# EAGLE design adrone_v1 (EAGLE 8.3.1)
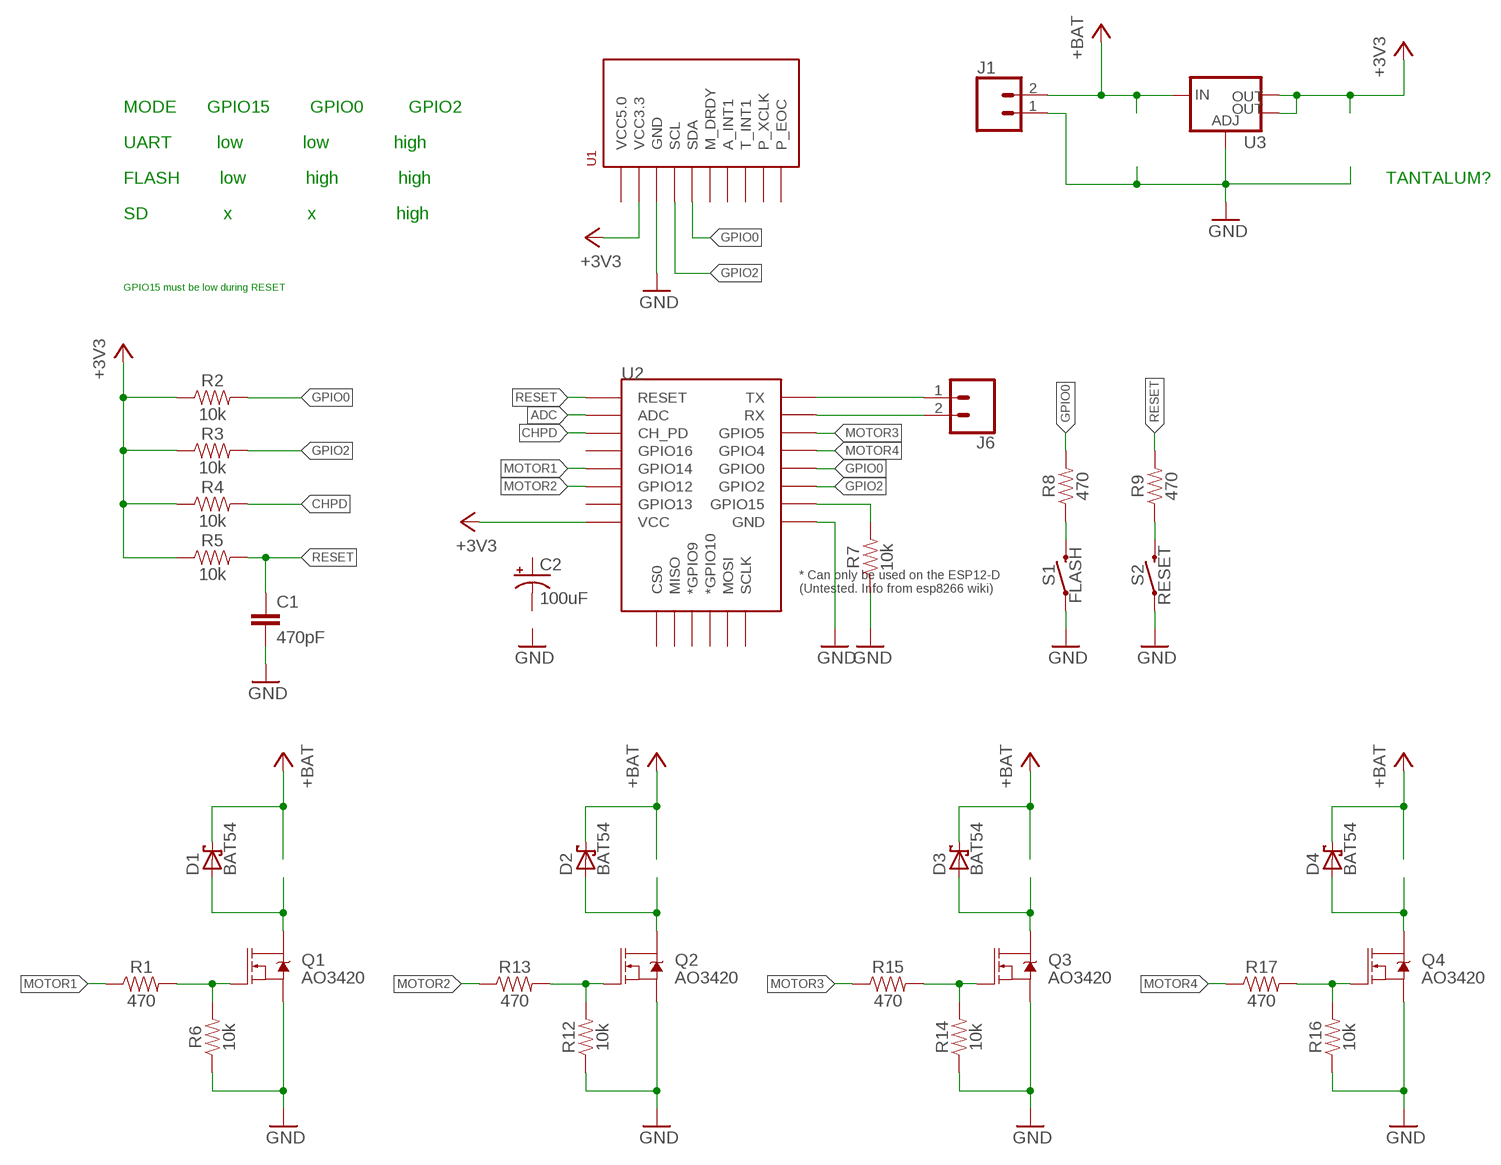
[diagram p0: schematic, sheet 1]

## Parts
C1  470pF  10NF-0603-50V-10%  [0603]
C2  100uF  100UF-POLAR-EIA7343-10V-10%(TANT)  [EIA7343]
D1  BAT54  [SOT23]
D2  BAT54  [SOT23]
D3  BAT54  [SOT23]
D4  BAT54  [SOT23]
J1  CONN_02  [1X02]
J6  CONN_02  [1X02]
Q1  AO3420  MOSFET-NCH-AO3404A  [SOT23-3]
Q2  AO3420  MOSFET-NCH-AO3404A  [SOT23-3]
Q3  AO3420  MOSFET-NCH-AO3404A  [SOT23-3]
Q4  AO3420  MOSFET-NCH-AO3404A  [SOT23-3]
R1  470  10KOHM-0603-1/10W-1%  [0603]
R2  10k  10KOHM-0603-1/10W-1%  [0603]
R3  10k  10KOHM-0603-1/10W-1%  [0603]
R4  10k  10KOHM-0603-1/10W-1%  [0603]
R5  10k  10KOHM-0603-1/10W-1%  [0603]
R6  10k  10KOHM-0603-1/10W-1%  [0603]
R7  10k  10KOHM-0603-1/10W-1%  [0603]
R8  470  470OHM-0603-1/10W-1%  [0603]
R9  470  470OHM-0603-1/10W-1%  [0603]
R12  10k  10KOHM-0603-1/10W-1%  [0603]
R13  470  10KOHM-0603-1/10W-1%  [0603]
R14  10k  10KOHM-0603-1/10W-1%  [0603]
R15  470  10KOHM-0603-1/10W-1%  [0603]
R16  10k  10KOHM-0603-1/10W-1%  [0603]
R17  470  10KOHM-0603-1/10W-1%  [0603]
S1  FLASH  MOMENTARY-SWITCH-SPST-SMD-6.0X3.5MM  [TACTILE_SWITCH_SMD_6.0X3.5MM]
S2  RESET  MOMENTARY-SWITCH-SPST-SMD-6.0X3.5MM  [TACTILE_SWITCH_SMD_6.0X3.5MM]
U1  GY-80_10DOF  [GY-80_10DOF]
U2  ESP12ESMD  [ESP12E-SMD]
U3  V_REG_LM1117SOT223  [SOT223]

## Nets
+3V3: R2.1 R3.1 R4.1 R5.1 U1.P$2(VCC3.3) U2.VCC U3.2(OUT) U3.4(OUT)
+BAT: D1.3(C) D2.3(C) D3.3(C) D4.3(C) J1.2 U3.3(IN)
ADC: U2.ADC
CHPD: R4.2 U2.CH_PD
GND: C1.2 J1.1 Q1.2(S) Q2.2(S) Q3.2(S) Q4.2(S) R6.1 R7.1 R12.1 R14.1 R16.1 S1.1 S2.1 U1.P$3(GND) U2.GND U3.1(ADJ)
GPIO0: R2.2 R8.2 U1.P$5(SDA) U2.GPIO0
GPIO2: R3.2 U1.P$4(SCL) U2.GPIO2
MOTOR1: R1.1 U2.GPIO14
MOTOR2: R13.1 U2.GPIO12
MOTOR3: R15.1 U2.GPIO5
MOTOR4: R17.1 U2.GPIO4
N$1: D1.1(A) Q1.3(D)
N$3: Q2.1(G) R12.2 R13.2
N$4: D2.1(A) Q2.3(D)
N$6: Q3.1(G) R14.2 R15.2
N$7: R7.2 U2.GPIO15
N$8: D3.1(A) Q3.3(D)
N$10: Q4.1(G) R16.2 R17.2
N$11: J6.2 U2.RXD0(RX)
N$12: D4.1(A) Q4.3(D)
N$14: Q1.1(G) R1.2 R6.2
N$18: R8.1 S1.2
N$20: R9.1 S2.2
RESET: C1.1 R5.2 R9.2 U2.RESET
TX: J6.1 U2.TXD0(TX)
Unconnected: C2.A(+) C2.C(-) U1.P$1(VCC5.0) U1.P$6(M_DRDY) U1.P$7(A_INT1) U1.P$8(T_INT1) U1.P$9(P_XCLK) U1.P$10(P_EOC) U2.CS0 U2.GPIO9(*GPIO9) U2.GPIO10(*GPIO10) U2.GPIO13 U2.GPIO16 U2.MISO U2.MOSI U2.SCLK

## Notes on the sheet
- MODE      GPIO15        GPIO0         GPIO2
- UART         low            low             high
- FLASH        low            high            high | TANTALUM?
- SD               x               x                high
- GPIO15 must be low during RESET

## Library data of the parts
C1 = SparkFun-Capacitors:10NF: 0.01uF/10nF/10,000pF ceramic capacitors A capacitor is a passive two-terminal electrical component used to store electrical energy temporarily in an electric field. CAP-09321; PROD_ID: CAP-00867; VALUE: 10nF
C2 = SparkFun-Capacitors:100UF-POLAR: 100µF polarized capacitors A capacitor is a passive two-terminal electrical component used to store electrical energy temporarily in an electric field.; PROD_ID: CAP-07890
D1-D4 = diode:BAT54: Schottky Diodes Source: Fairchild .. BAT54.pdf
J1 J6 = SparkFun-Connectors:CONN_02: Multi connection point. Often used as Generic Header-pin footprint for 0.1 inch spaced/style header connections On any of the 0.1 inch spaced packages, you can populate with these: Break Away Headers - Straight <https://www.sparkfun.com/products/116> (PRT-00116) Break Away Male Headers - Right Angle <https://www.sparkfun.com/products/553> (PRT-00553) Female Headers <https://www.sparkfun.com/products/115> (PRT-00115) Break Away Headers - Machine Pin <https://www.sparkfun.com/products/117> (PRT-00117) Break Away Female Headers - Swiss Machine Pin <https://www.sparkfun.com/products/743> (PRT-00743) For SCREWTERMINALS and SPRING TERMINALS visit here: Screw Terimnals on SparkFun.com <https://www.sparkfun.com/search/results?term=Screw+Terminals> (5mm/3.5mm/2.54mm spacing) This device is also useful as a general connection point to wire up your design to another part of your project. Our various solder wires solder well into these plated through hole pads. Hook-Up Wire - Assortment (Stranded, 22 AWG) <https://www.sparkfun.com/products/11375> (PRT-11375) Hook-Up Wire - Assortment (Solid Core, 22 AWG) <https://www.sparkfun.com/products/11367> (PRT-11367) View the entire wire category on our website here <https://www.sparkfun.com/categories/141> Special notes: Molex polarized connector foot print use with: PRT-08233 with associated crimp pins and housings. 2.54_SCREWTERM for use with PRT-10571. 3.5mm Screw Terminal footprints for PRT-08084 5mm Screw Terminal footprints for use with PRT-08432
Q1-Q4 = SparkFun-DiscreteSemi:MOSFET-NCH: N-channel MOSFETs Voltage controlled devices that allow control of high current outputs. SparkFun Products: SparkFun OpenScale <https://www.sparkfun.com/products/13261> SparkFun Digital Sandbox <https://www.sparkfun.com/products/12651> SparkFun Monster Moto Shield <https://www.sparkfun.com/products/10182> SparkFun MOSFET Power Controller <https://www.sparkfun.com/products/11214>; PROD_ID: TRANS-12988; VALUE: 5.8A/30V/35mΩ
R1 R13 R15 R17 = SparkFun-Resistors:10KOHM: 10kΩ resistor A resistor is a passive two-terminal electrical component that implements electrical resistance as a circuit element. Resistors act to reduce current flow, and, at the same time, act to lower voltage levels within circuits. - Wikipedia; PROD_ID: RES-00824; VALUE: 10k
R2-R7 R12 R14 R16 = SparkFun-Resistors:10KOHM: 10kΩ resistor A resistor is a passive two-terminal electrical component that implements electrical resistance as a circuit element. Resistors act to reduce current flow, and, at the same time, act to lower voltage levels within circuits. - Wikipedia; PROD_ID: RES-00824
R8 R9 = SparkFun-Resistors:470OHM: 470Ω resistor A resistor is a passive two-terminal electrical component that implements electrical resistance as a circuit element. Resistors act to reduce current flow, and, at the same time, act to lower voltage levels within circuits. - Wikipedia; PROD_ID: RES-07869
S1 S2 = SparkFun-Switches:MOMENTARY-SWITCH-SPST: Momentary Switch (Pushbutton) - SPST Normally-open (NO) SPST momentary switches (buttons, pushbuttons). Variants PTH-12MM - 12mm square, through-hole Momentary Pushbutton Switch - 12mm Square <https://www.sparkfun.com/products/9190> (COM-09190) PTH-6.0MM, PTH-6.0MM-KIT - 6.0mm square, through-hole Mini Pushbutton Switch <https://www.sparkfun.com/products/97> (COM-00097) KIT package intended for soldering kit's - only one side of pads' copper is exposed. PTH-RIGHT-ANGLE-KIT - Right-angle, through-hole Right Angle Tactile Button <https://www.sparkfun.com/products/10791> - Used on SparkFun BigTime Watch Kit <https://www.sparkfun.com/products/11734> SMD-12MM - 12mm square, surface-mount Tactile Button - SMD (12mm) <https://www.sparkfun.com/products/12993> (COM-12993) Used on SparkFun PicoBoard <https://www.sparkfun.com/products/11888> SMD-4.5MM - 4.5mm Square Trackball Switch Used on SparkFun Blackberry Trackballer Breakout <https://www.sparkfun.com/products/13169> SMD-4.6MMX2.8MM - 4.60mm x 2.80mm, surface mount Used on SparkFun SAMD21 Mini Breakout <https://www.sparkfun.com/products/13664> SMD-5.2MM, SMD-5.2-REDUNDANT - 5.2mm square, surface-mount Mini Pushbutton Switch - SMD <https://www.sparkfun.com/products/8720> (COM-08720) Used on Arduino Pro Mini <https://www.sparkfun.com/products/11114> REDUNDANT package connects both switch circuits together SMD-6.0X3.5MM - 6.0 x 3.5mm, surface mount Momentary Reset Switch SMD <https://www.sparkfun.com/products/8229> (COM-08229) SMD-6.2MM-TALL - 6.2mm square, surface mount Tactile Button - SMD (6mm) <https://www.sparkfun.com/products/12992> Used on SparkFun Digital Sandbox <https://www.sparkfun.com/products/12651> SMD-RIGHT-ANGLE - Right-angle, surface mount Used on SparkFun Block for Intel® Edison - Arduino <https://www.sparkfun.com/products/13036>; PROD_ID: SWCH-00815; SF_SKU: COM-08229
U1 = 1AugustoLib:GY-80_10DOF
U2 = esp8266modules:ESP12E: ESP12E Module
U3 = SparkFun-IC-Power:V_REG_LM1117: Voltage Regulator LM1117 Standard adjustable voltage regulator but in SMD form. Spark Fun Electronics SKU : COM-00595; PROD_ID: VREG-08170

## Board
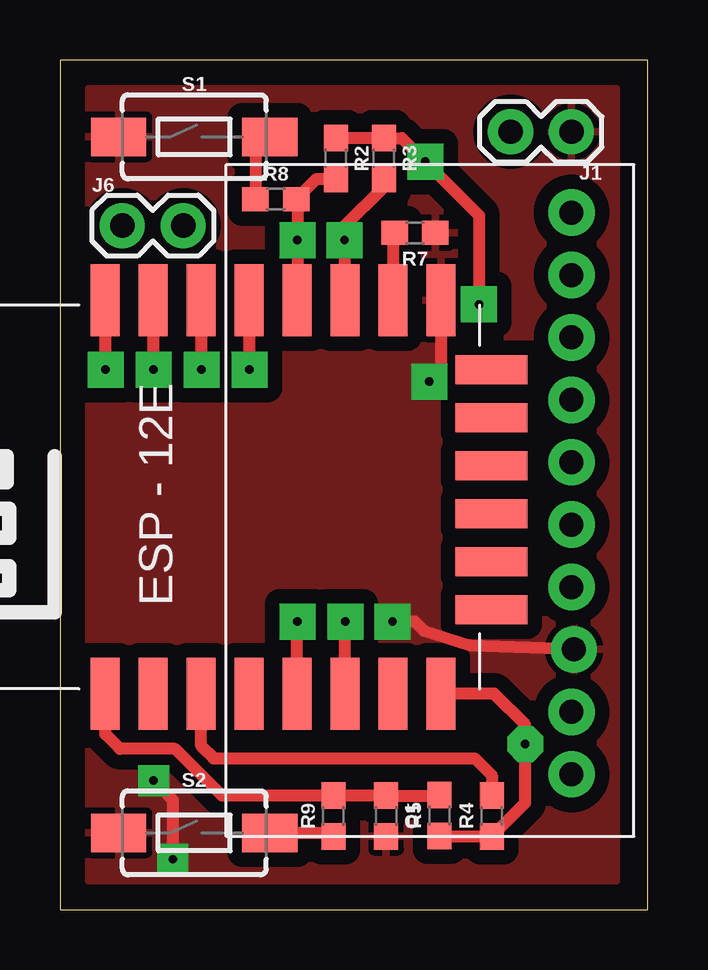
[diagram p1: board, top side]
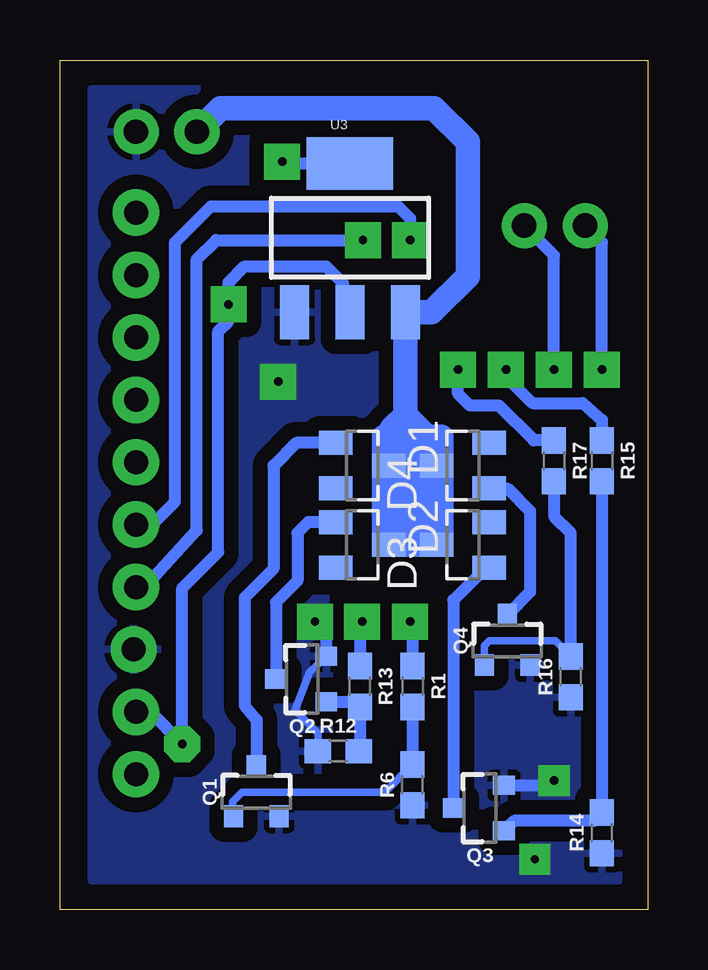
[diagram p2: board, bottom side, seen from below]

Size 24.5 x 35.4 mm. Coordinates in mm from the lower left corner, seen from the top.
Outline: 0,0 24.5,0 24.5,35.4 0,35.4 0,0
Copper layers (1*16): Top 0.035mm / dielectric 1.5mm / Bottom 0.035mm
Design rules "default": minimum track width 6mil, minimum drill 0.35mm, track to track 6mil, track to pad 6mil, pad to pad 6mil, via to via 6mil, smd to smd 6mil, copper to edge 40mil, drill to drill 6mil, minimum pad ring 10mil, minimum via ring 8mil, stop-mask expansion 4mil, vias tented up to drill 0mil, thermal gap 10mil

### Footprints (pad centres in the part's own frame; a part is rotated, then mirrored left to right if it is on the bottom)
0603 = smd 1.1 x 1: 1 -0.85,0; 2 0.85,0
EIA7343 = smd 2.55 x 2.7: A 3.17,0; C -3.17,0
SOT23 = smd 1 x 1.4: 1 -0.95,-1.1; 2 0.95,-1.1; 3 0,1.1
1X02 = drill 1.016 pad 1.88: 1 0,0; 2 2.54,0
SOT23-3 = smd 0.8 x 0.9: 1 -0.95,-1; 2 0.95,-1; 3 0,1.1
TACTILE_SWITCH_SMD_6.0X3.5MM = smd 2.3 x 1.6: 1 -3.15,0; 2 3.15,0
GY-80_10DOF = drill 1 pad 1.93: P$1 2.6,2.6; P$2 5.2,2.6; P$3 7.8,2.5; P$4 10.4,2.6; P$5 13,2.6; P$6 15.6,2.6; P$7 18.2,2.6; P$8 20.8,2.6; P$9 23.4,2.6; P$10 26,2.6
ESP12E-SMD = smd 3 x 1.2: ADC -8.3,3.8; CH_PD -8.3,1.8; GND 8.1,-8.2; GPIO0 8.1,-2.2; GPIO2 8.1,-4.2; GPIO4 8.1,-0.2; GPIO5 8.1,1.8; GPIO12 -8.3,-4.2; GPIO13 -8.3,-6.2; GPIO14 -8.3,-2.2; GPIO15 8.1,-6.2; GPIO16 -8.3,-0.2; RESET -8.3,5.8; RXD0 8.1,3.8; TXD0 8.1,5.8; VCC -8.3,-8.2 | smd 1.2 x 3: CS0 -4.8,-10.3; GPIO9 -0.8,-10.3; GPIO10 1.2,-10.3; MISO -2.8,-10.3; MOSI 3.2,-10.3; SCLK 5.2,-10.3
SOT223 = smd 1.219 x 2.235: 1 -2.311,-3.099; 2 0,-3.099; 3 2.311,-3.099 | smd 3.6 x 2.2: 4 0,3.099

### Placement (x,y rotation side)
C1  13.6,3.9 270 top
C2  -7.33,48.67 0 top  (outside the outline)
D1  11.9,18.5 270 bottom
D2  11.9,15.2 270 bottom
D3  7.7,15.2 90 bottom
D4  7.7,18.5 90 bottom
J1  21.33,32.41 180 top
J6  2.6,28.5 0 top
Q1  16.31,4.89 0 bottom
Q2  14.39,9.61 90 bottom
Q3  6.99,4.23 90 bottom
Q4  5.85,11.19 0 bottom
R1  9.8,9.3 270 bottom
R2  11.5,31.3 270 top
R3  13.5,31.3 270 top
R4  18,3.9 90 top
R5  15.83,3.92 90 top
R6  9.8,5.2 90 bottom
R7  14.8,28.2 180 top
R8  9,29.6 0 top
R9  11.4,3.9 90 top
R12  12.9,6.6 0 bottom
R13  12,9.3 270 bottom
R14  1.9,3.2 90 bottom
R15  1.9,18.7 270 bottom
R16  3.2,9.7 90 bottom
R17  3.9,18.7 270 bottom
S1  5.6,32.2 0 top
S2  5.6,3.2 0 top
U1  23.93,3.04 90 top
U2  7.69,17.3 90 top
U3  12.41,27.99 0 bottom

### Tracks (layer width: path | path; a pad name or v marks a point on that pad's centre or on a via)
+3V3  (via drill 0.35 pad 1.5)
  Top 0.508: R5.1 15.85,3.05 R4.1 19.4,4.45 v19.4,6.9 19.4,7.7 18.1,9 U2.VCC | R2.1 R3.1 14.25,32.15 v15.24,31.16 17.48,28.92 v17.48,25.21
  Bottom 0.508: U1.P$2 20.74,8.24 v19.4,6.9 19.4,13.4 17.9,14.9 17.9,24.1 17.48,24.52 v17.48,25.21 17.48,26.12 16.8,26.8 13.4,26.8 12.7,26.1 12.7,24.9 U3.2 | v15.24,31.16 15.16,31.09 U3.4
+BAT
  Bottom 1.016: J1.2 17.8,33.4 8.9,33.4 7.5,32 7.5,26.4 9.01,24.89 U3.3 10.1,20.6 | 9.91,19.61 9.45,19.15 | 9.45,19.15 D4.3 8.6,18.3 8.6,16 | 9.91,19.61 10.1,19.8 10.1,20.6 | 9.91,19.39 D1.3 | 9.91,19.39 9.91,19.61 | 9.91,16.31 D3.3 | 9.91,17.96 9.91,16.31 | 9.91,18.61 9.91,17.96 | 9.91,18.61 9.91,19.39 | D2.3 9.91,16.09 9.91,16.31 | 9.91,19.61 9.82,19.7 9.26,19.7 | 9.26,19.7 8.6,19.7 | 8.6,19.7 8.6,19 | D1.3 11,18.7 11,19.7 10.65,19.7 | 10.65,19.7 9.26,19.7 | 9.26,19.7 8.6,19.7 | D1.3 11,18.3 11,15.4 | D1.3 10.4,18.1 10.4,16.4 | 8.6,16 9.4,16.8 9.4,17.6 | D3.3 8.6,15.4 8.6,16 | D3.3 D2.3 | D2.3 11,15.4 | 11,15.4 9.91,16.49 9.91,17.96 | 9.64,20.14 10.1,20.6 | 9.64,20.14 9.26,19.76 9.26,19.7 | 9.45,19.15 9.26,19.34 9.26,19.7 | 10.1,20.6 10.65,20.05 10.65,19.7 | 10.65,19.7 10.21,20.14 9.64,20.14 | 10.1,20.6 9.91,20.41 9.91,18.61
CHPD
  Top 0.508: 5.9,9.39 U2.CH_PD 5.89,6.81 6.4,6.3 17.3,6.3 18,5.6 R4.2
GND  (via drill 0.35 pad 1.3, 0.35 pad 1.5)
  Top 0.508: U1.P$3 17.1,11 15.2,11.6 14.8,12 v13.86,12 13.6,12 | U2.GND 15.89,22.49 v15.4,22 | v3.9,5.37 4.7,4.57 v4.7,2.1
  Bottom 0.305: R12.1 13.75,7.35 14.7,8.3 14.1,9.9 Q2.2
  Bottom 0.508: Q3.2 4.09,5.18 v3.9,5.37 | Q2.2 13.39,11.53 v13.86,12
  pour Top (isolate 0.61): 1.2,34.2 1.2,1.2 23.2,1.2 23.2,34.2
  pour Bottom (isolate 0.61): 1.2,34.2 1.2,1.2 23.2,1.2 23.2,34.2
GPIO0  (via drill 0.35 pad 1.5)
  Top 0.508: U2.GPIO0 v9.9,27.9 9.9,29.55 R8.2 10.7,30.45 R2.2
  Bottom 0.508: v9.9,27.9 9.9,28.8 10.4,29.3 18.2,29.3 19.7,27.8 19.7,17 20.66,16.04 U1.P$5
GPIO2  (via drill 0.35 pad 1.5)
  Top 0.508: U2.GPIO2 12,25.51 11.86,25.65 v11.86,27.9 11.86,28.46 13.5,30.1 R3.2
  Bottom 0.508: 21.16,13.64 U1.P$4 20.96,13.44 18.8,15.8 18.8,27.1 18,27.9 v11.86,27.9 11.8,27.9
MOTOR1  (via drill 0.35 pad 1.5)
  Top 0.508: U2.GPIO14 v9.89,11.99 v9.9,12
  Bottom 0.508: v9.9,12 9.8,11.9 R1.1
MOTOR2  (via drill 0.35 pad 1.5)
  Top 0.508: U2.GPIO12 v11.89,11.99 v11.9,12
  Bottom 0.508: v11.9,12 12,11.9 R13.1
MOTOR3  (via drill 0.35 pad 1.5)
  Top 0.508: U2.GPIO5 v5.89,22.51 v5.9,22.5
  Bottom 0.508: R15.1 1.9,20.4 2.7,21.1 4.8,21.1 5.9,22.2 v5.9,22.5
MOTOR4  (via drill 0.35 pad 1.5)
  Top 0.508: U2.GPIO4 v7.89,22.51 v7.9,22.5
  Bottom 0.508: R17.1 4.75,19.55 6.2,21 7.4,21 7.9,21.5 v7.9,22.5
N$1
  Bottom 0.508: D1.1 14.65,19.45 15.6,18.5 15.6,14.2 16.8,13 16.8,8.5 16.3,7.9 16.31,7.89 Q1.3
N$3
  Bottom 0.508: R12.2 12,6.65 R13.2 12.21,8.66 Q2.1
N$4
  Bottom 0.508: D2.1 14.15,16.15 14.6,15.7 14.6,13.7 15.5,12.8 Q2.3
N$6
  Bottom 0.508: R15.2 R14.2 2.25,3.7 5.57,3.7 Q3.1
N$7
  Top 0.508: R7.2 13.89,28.14 U2.GPIO15
N$8
  Bottom 0.508: D3.1 6.75,14.25 8.1,12.9 Q3.3
N$10
  Bottom 0.305: Q4.1 6.8,11 6.6,11.2 3.85,11.2 R16.2
  Bottom 0.508: R17.2 3.9,16.4 3.2,15.7 R16.2
N$11  (via drill 0.35 pad 1.5)
  Top 0.508: U2.RXD0 3.89,22.91 v3.9,22.5
  Bottom 0.508: v3.9,22.5 3.9,27.26 J6.2
N$12
  Bottom 0.508: D4.1 5.85,17.55 4.9,16.6 4.9,13.24 Q4.3
N$14
  Bottom 0.305: R6.2 10.95,4.9 16.9,4.9 17.3,4.5 17.3,3.93 Q1.1
  Bottom 0.508: R1.2 R6.2
N$18
  Top 0.508: 8.8,32.25 S1.2 8.15,31.6 R8.1
N$20
  Top 0.508: S2.2 11.25,3.2 R9.1
RESET
  Top 0.508: R5.2 15.81,4.75 C1.1 R9.2 6.75,4.75 4.8,6.7 2.5,6.7 1.9,7.3 U2.RESET 1.9,9.39
TX  (via drill 0.35 pad 1.5)
  Top 0.508: U2.TXD0 1.89,22.9 v1.9,22.5
  Bottom 0.508: v1.9,22.5 1.9,27.8 J6.1